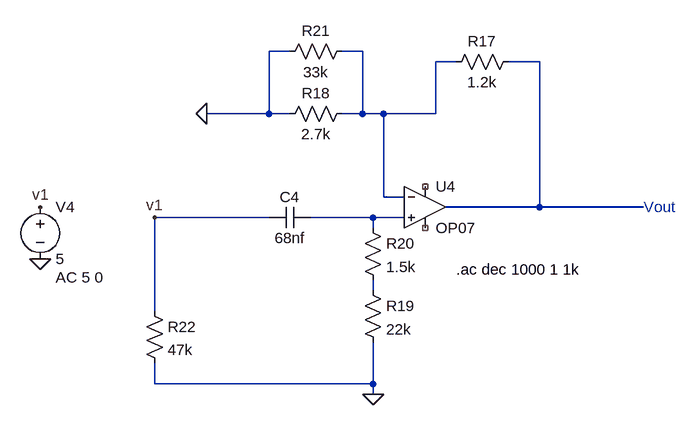
[diagram p0: schematic Design1.asc]
Design1.asc, the LTspice schematic file:
Version 4
SHEET 1 1264 680
WIRE -1344 -1568 -1376 -1568
WIRE -1232 -1568 -1264 -1568
WIRE -1088 -1552 -1120 -1552
WIRE -960 -1552 -1008 -1552
WIRE -1376 -1472 -1376 -1568
WIRE -1376 -1472 -1472 -1472
WIRE -1344 -1472 -1376 -1472
WIRE -1232 -1472 -1232 -1568
WIRE -1232 -1472 -1264 -1472
WIRE -1200 -1472 -1232 -1472
WIRE -1120 -1472 -1120 -1552
WIRE -1120 -1472 -1200 -1472
WIRE -1200 -1344 -1200 -1472
WIRE -1168 -1344 -1200 -1344
WIRE -960 -1328 -960 -1552
WIRE -960 -1328 -1104 -1328
WIRE -800 -1328 -960 -1328
WIRE -1376 -1312 -1552 -1312
WIRE -1216 -1312 -1312 -1312
WIRE -1168 -1312 -1216 -1312
WIRE -1216 -1296 -1216 -1312
WIRE -1216 -1200 -1216 -1216
WIRE -1552 -1168 -1552 -1312
WIRE -1552 -1056 -1552 -1088
WIRE -1216 -1056 -1216 -1120
WIRE -1216 -1056 -1552 -1056
WIRE -1216 -1040 -1216 -1056
FLAG -1472 -1472 0
FLAG -1216 -1040 0
FLAG -1728 -1248 0
FLAG -1728 -1328 v1
FLAG -1552 -1312 v1
SYMBOL voltage -1728 -1344 R0
WINDOW 123 24 124 Left 2
WINDOW 39 0 0 Left 0
SYMATTR Value2 AC 5 0
SYMATTR InstName V4
SYMATTR Value 5
SYMBOL OpAmps\\OP07 -1136 -1392 R0
SYMATTR InstName U4
SYMBOL res -992 -1568 R90
WINDOW 0 0 56 VBottom 2
WINDOW 3 32 56 VTop 2
SYMATTR InstName R17
SYMATTR Value 1.2k
SYMBOL res -1248 -1488 R90
WINDOW 0 0 56 VBottom 2
WINDOW 3 32 56 VTop 2
SYMATTR InstName R18
SYMATTR Value 2.7k
SYMBOL res -1232 -1216 R0
SYMATTR InstName R19
SYMATTR Value 22k
SYMBOL cap -1312 -1328 R90
WINDOW 0 0 32 VBottom 2
WINDOW 3 32 32 VTop 2
SYMATTR InstName C4
SYMATTR Value 68nf
SYMBOL res -1232 -1312 R0
SYMATTR InstName R20
SYMATTR Value 1.5k
SYMBOL res -1248 -1584 R90
WINDOW 0 0 56 VBottom 2
WINDOW 3 32 56 VTop 2
SYMATTR InstName R21
SYMATTR Value 33k
SYMBOL res -1568 -1184 R0
SYMATTR InstName R22
SYMATTR Value 47k
TEXT -800 -1328 Left 2 ;Vout
TEXT -1088 -1232 Left 2 !.ac dec 1000 1 1k

The netlist it stands for:
* Design1.asc
V4 v1 0 5 AC 5 0
XU4 N003 N001 NC_01 NC_02 N002 LT1001  ; OP07, pins In+ In- V+ V- OUT
R17 N002 N001 1.2k
R18 N001 0 2.7k
R19 N004 0 22k
C4 N003 v1 68nf
R20 N003 N004 1.5k
R21 N001 0 33k
R22 v1 0 47k
* Vout
.ac dec 1000 1 1k
.lib LTC.lib
.backanno
.end